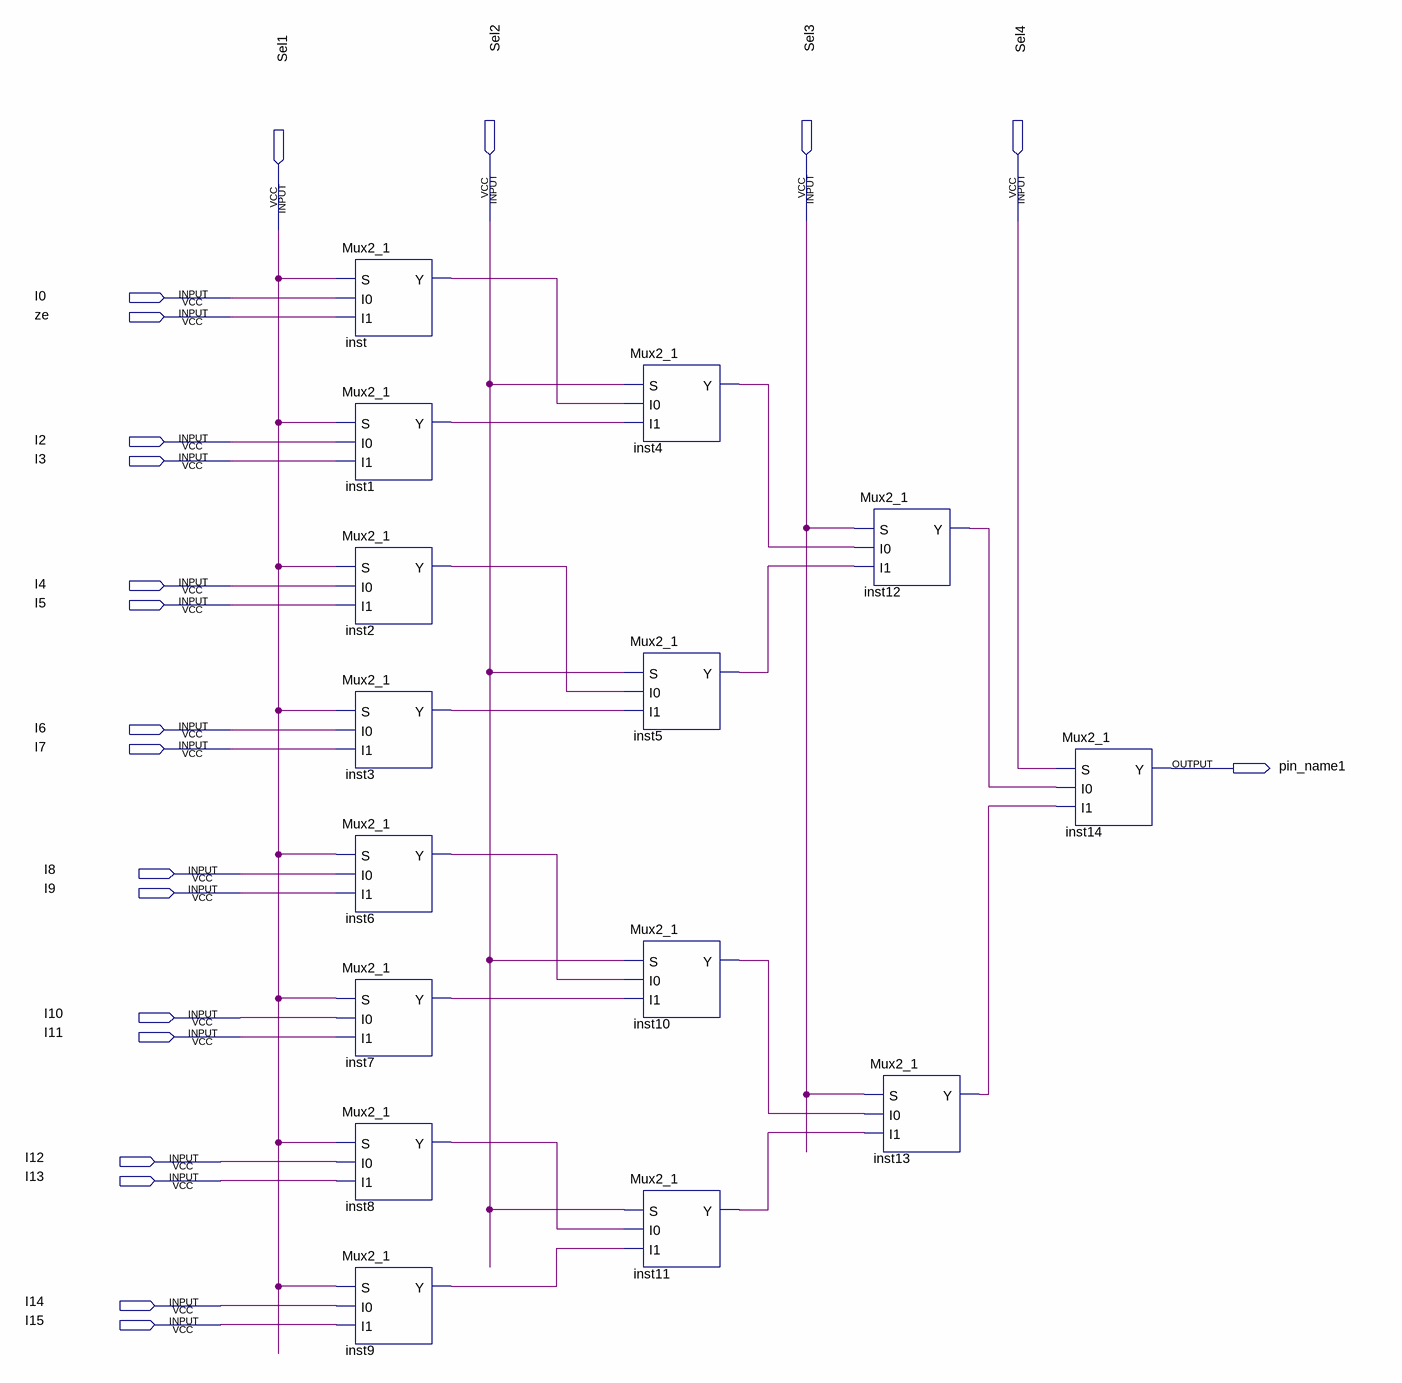
[diagram p0: schematic sheet]
// Quartus schematic Mux16_1.bdf as structural Verilog: 15 symbols, 21 pins
module Mux16_1 (
  input  Sel2,
  input  Sel3,
  input  Sel4,
  input  Sel1,
  input  I0,
  input  ze,
  input  I2,
  input  I3,
  input  I4,
  input  I5,
  input  I6,
  input  I7,
  input  I8,
  input  I9,
  input  I10,
  input  I11,
  input  I12,
  input  I13,
  input  I14,
  input  I15,
  output pin_name1
);

  wire inst1_y, inst2_y, inst3_y, inst4_y, inst5_y, inst6_y, inst7_y, inst8_y, inst9_y, inst10_y, inst11_y,
       inst12_y, inst13_y, inst_y;

  Mux2_1 inst (.S(Sel1), .I0(I0), .I1(ze), .Y(inst_y));
  Mux2_1 inst1 (.S(Sel1), .I0(I2), .I1(I3), .Y(inst1_y));
  Mux2_1 inst2 (.S(Sel1), .I0(I4), .I1(I5), .Y(inst2_y));
  Mux2_1 inst3 (.S(Sel1), .I0(I6), .I1(I7), .Y(inst3_y));
  Mux2_1 inst6 (.S(Sel1), .I0(I8), .I1(I9), .Y(inst6_y));
  Mux2_1 inst7 (.S(Sel1), .I0(I10), .I1(I11), .Y(inst7_y));
  Mux2_1 inst8 (.S(Sel1), .I0(I12), .I1(I13), .Y(inst8_y));
  Mux2_1 inst9 (.S(Sel1), .I0(I14), .I1(I15), .Y(inst9_y));
  Mux2_1 inst4 (.S(Sel2), .I0(inst_y), .I1(inst1_y), .Y(inst4_y));
  Mux2_1 inst5 (.S(Sel2), .I0(inst2_y), .I1(inst3_y), .Y(inst5_y));
  Mux2_1 inst10 (.S(Sel2), .I0(inst6_y), .I1(inst7_y), .Y(inst10_y));
  Mux2_1 inst11 (.S(Sel2), .I0(inst8_y), .I1(inst9_y), .Y(inst11_y));
  Mux2_1 inst12 (.S(Sel3), .I0(inst4_y), .I1(inst5_y), .Y(inst12_y));
  Mux2_1 inst13 (.S(Sel3), .I0(inst10_y), .I1(inst11_y), .Y(inst13_y));
  Mux2_1 inst14 (.S(Sel4), .I0(inst12_y), .I1(inst13_y), .Y(pin_name1));
endmodule
